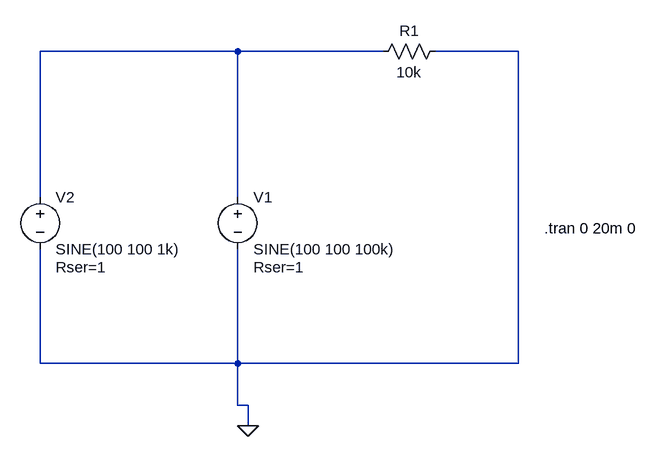
[diagram p0: schematic test.asc]
test.asc, the LTspice schematic file:
Version 4
SHEET 1 880 680
WIRE 96 80 -208 80
WIRE 320 80 96 80
WIRE 528 80 400 80
WIRE -208 304 -208 80
WIRE 96 304 96 80
WIRE -208 560 -208 384
WIRE 96 560 96 384
WIRE 96 560 -208 560
WIRE 528 560 528 80
WIRE 528 560 96 560
WIRE 96 624 96 560
WIRE 112 624 96 624
WIRE 112 656 112 624
FLAG 112 656 0
SYMBOL voltage 96 288 R0
WINDOW 123 0 0 Left 0
WINDOW 39 24 124 Left 2
SYMATTR SpiceLine Rser=1
SYMATTR InstName V1
SYMATTR Value SINE(100 100 100k)
SYMBOL res 416 64 R90
WINDOW 0 0 56 VBottom 2
WINDOW 3 32 56 VTop 2
SYMATTR InstName R1
SYMATTR Value 10k
SYMBOL voltage -208 288 R0
WINDOW 123 0 0 Left 0
WINDOW 39 24 124 Left 2
SYMATTR SpiceLine Rser=1
SYMATTR InstName V2
SYMATTR Value SINE(100 100 1k)
TEXT 568 352 Left 2 !.tran 0 20m 0

The netlist it stands for:
* test.asc
V1 N001 0 SINE(100 100 100k) Rser=1
R1 0 N001 10k
V2 N001 0 SINE(100 100 1k) Rser=1
.tran 0 20m 0
.backanno
.end